# Altium schematic sheet AV Channel.SchDoc
size A4
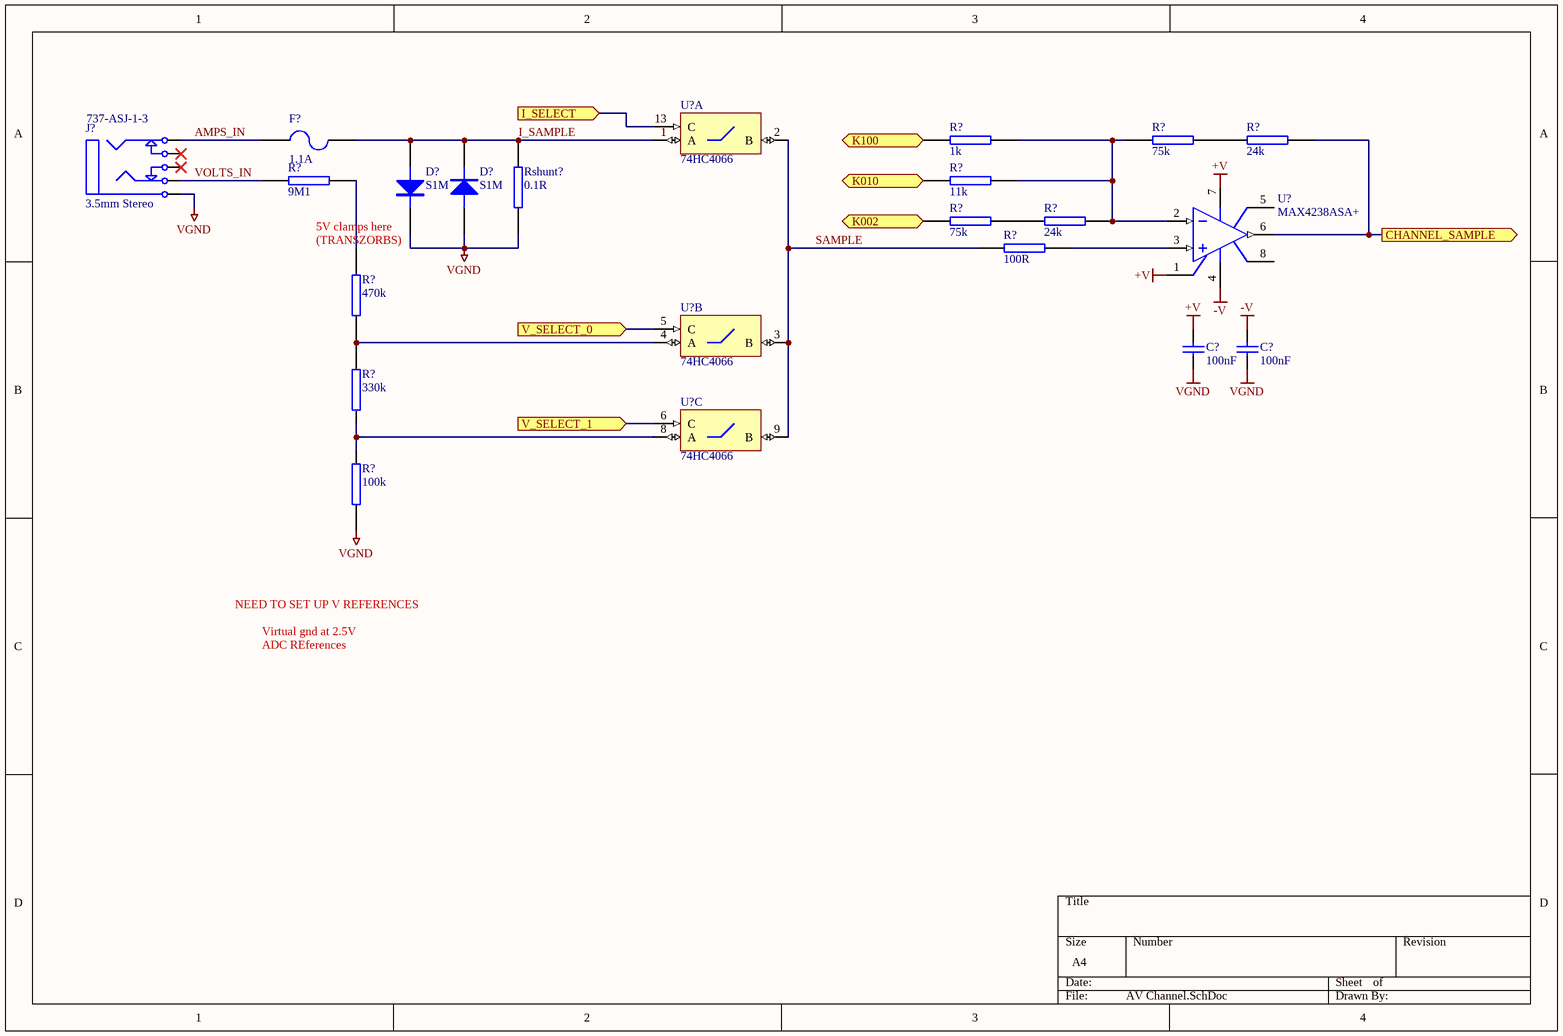
[diagram p0: AV Channel.SchDoc]

## Parts
(Parts that share a designator on the sheet are numbered #1, #2 ... from top to bottom, then left to right.)
C?#1  100nF  [CAP (3D) - 0603]
C?#2  100nF  [CAP (3D) - 0603]
D?#1  S1M  [DO-214AC]
D?#2  S1M  [DO-214AC]
F?  1.1A  [LITTELFUSE 1210]
J?  3.5mm Stereo  Supplier Part Number 1: 737-ASJ-1-3  [3.5MM pcb mouNt]
R?#1  1k  [RES (3D) - 0603]
R?#2  75k  [RES (3D) - 0603]
R?#3  24k  [RES (3D) - 0603]
R?#4  9M1  [RES (3D) - 0603]
R?#5  11k  [RES (3D) - 0603]
R?#6  75k  [RES (3D) - 0603]
R?#7  24k  [RES (3D) - 0603]
R?#8  100R  [RES (3D) - 0603]
R?#9  470k  [RES (3D) - 0603]
R?#10  330k  [RES (3D) - 0603]
R?#11  100k  [RES (3D) - 0603]
Rshunt?  0.1R  [1T-2512]
U?#1  74HC4066  [D014_N]  (part A of 5)
U?#2  MAX4238ASA+  [NSO8_N]
U?#3  74HC4066  [D014_N]  (part B of 5)
U?#4  74HC4066  [D014_N]  (part C of 5)

## Ports
CHANNEL_SAMPLE (out), I_SELECT (in), K002 (in), K010 (in), K100 (in), V_SELECT_0 (in), V_SELECT_1 (in)

## Nets
+V: C?#1.2 U?#2.1(NULL)
-V: C?#2.2 U?#2.4(VEE)
VGND: C?#1.1 C?#2.1 D?#1.2(K) D?#2.1(A) J?.1 R?#11.2 Rshunt?.1
AMPS_IN: F?.1 J?.5
CHANNEL_SAMPLE: R?#3.2 U?#2.6(OUT) ; port CHANNEL_SAMPLE
I_SAMPLE: D?#1.1(A) D?#2.2(K) F?.2 Rshunt?.2 U?#1.1(A)
I_SELECT: U?#1.13(C) ; port I_SELECT
K002: R?#6.1 ; port K002
K010: R?#5.1 ; port K010
K100: R?#1.1 ; port K100
SAMPLE: R?#8.1 U?#1.2(B) U?#3.3(B) U?#4.9(B)
V_SELECT_0: U?#3.5(C) ; port V_SELECT_0
V_SELECT_1: U?#4.6(C) ; port V_SELECT_1
VOLTS_IN: J?.2 R?#4.1
NetR?#1_2: R?#1.2 R?#2.1 R?#5.2 R?#7.2 U?#2.2(IN-)
NetR?#2_2: R?#2.2 R?#3.1
NetR?#4_2: R?#4.2 R?#9.1
NetR?#6_2: R?#6.2 R?#7.1
NetR?#8_2: R?#8.2 U?#2.3(IN+)
NetR?#9_2: R?#9.2 R?#10.1 U?#3.4(A)
NetR?#10_2: R?#10.2 R?#11.1 U?#4.8(A)

Not connected (* = marked no-connect by the designer): J? 3* 4*; U?#2 5(NULL) 7(VCC) 8(NC)

## Notes on the sheet
- (near D?#1) 5V clamps here
- (TRANSZORBS)
- NEED TO SET UP V REFERENCES
- Virtual gnd at 2.5V
- ADC REferences
- Labels drawn without touching a wire or pin: +V

## Library data of the parts
C?#1 C?#2 = Cap: Capacitor; Value: 100nF; Supplier 1: Mouser; Supplier 2: Digi-Key; Supplier Part Number 1: 603-C0603ZRY5V9BB104; Supplier Part Number 2: 311-1343-2-ND
D?#1 D?#2 = DIODE: DIODE, POWER; Manufacturer: TAIWAN SEMI; Mouser Part no.: 821-S1M; Manufacturer Part No.: S1M; value: S1M; Web link: http://au.mouser.com/ProductDetail/Taiwan-Semiconductor/S1M/?qs=sGAEpiMZZMtEwUVCuofpuOlSmRjzJonf%252bmrIm0%252bGbjE%3d
F? = Fuse 2: Fuse; Manufacturer: Littlefuse; Manufacturer Part No.: 1206L110THYR; Revision: July-2002: Re-released for DXP Platform.; Mouser Part No.: 576-1206L110THYR; Value: 1.1A; Web link: http://au.mouser.com/ProductDetail/Littelfuse/1206L110THYR/?qs=sGAEpiMZZMu7EFbsM1w0ne5Dyqsx7igC3NaPmo8Qtk8%3d
J? = Phonejack Stereo SW: 3-Conductor Jack with 2 break contacts (normals) and 2 auxiliary make contacts; Altronics Part no.: P0073; Manufacturer: Neutrik; Manufacturer Part No.: NMJ6HFD2; Mouser Part no.: 550-20301; Web link: http://au.mouser.com/ProductDetail/Neutrik/NMJ6HFD2/?qs=y5MlCMoPWsng3r9W7xlRqw%3d%3d; Supplier 1: Mouser
R?#1-R?#3 R?#5-R?#8 = RES SMD 0603: RESISTOR SMD 0603
  R?#1: value: 1k
  R?#2 R?#6: value: 75k
  R?#3 R?#7: value: 24k
  R?#5: value: 11k
  R?#8: value: 100R
R?#4 = RES SMD 0603 10k: RESISTOR SMD 0603 10k; Manufacturer: Vishay/Dale; Manufacturer Part No.: CRCW06038M06FKEA; Mouser Part no.: 71-CRCW0603-8.06M-E3; Web link: http://au.mouser.com/ProductDetail/Vishay/CRCW06038M06FKEA/?qs=y%252bMD5VLd6nuCUjzPeM%2fNuA%3d%3d; value: 9M1
R?#9-R?#11 = RES SMD 0603 10k: RESISTOR SMD 0603 10k; Manufacturer: 71-CRCW0603-1.62M-E3; Manufacturer Part No.: CRCW06031M62FKEA; Mouser Part no.: Vishay/Dale; Web link: http://au.mouser.com/ProductDetail/Vishay-Dale/CRCW06031M62FKEA/?qs=T8SocJY5PJGlLyODpclhGBx5u7VrWxQmuiInBv9Pchc%3d
  R?#9: value: 470k
  R?#10: value: 330k
  R?#11: value: 100k
Rshunt? = RES SMD 0603 10k: RESISTOR SMD 0603; Manufacturer: Bourns; Manufacturer Part No.: CRM2512-FX-R100ELF; Mouser Part no.: 652-CRM2512FXR100ELF; Web link: http://au.mouser.com/ProductDetail/Bourns/CRM2512-FX-R100ELF/?qs=sGAEpiMZZMtlubZbdhIBIArpNfnoOiiHuLMy8C%2fxrAQ%3d; value: 0.1R
U?#1 U?#3 U?#4 = 74HC4066: Quadruple Bilateral Analog Switch
U?#2 = MAX495CSA: Single Voltage-Feedback Operational Amplifier; Published: 23-Sep-2002; LatestRevisionDate: 13-Apr-2006; LatestRevisionNote: IPC-7351 Footprint Added.; DatasheetVersion: Rev 2; 9/96; PackageReference: NSO8; Publisher: Altium Limited; PackageDescription: 8-Pin Small Outline Integrated Circuit 1.27 mm Pitch; Code_JEDEC: MS-012-AA; Code_IPC: SOIC127P600-8; ComponentLink1Description: Manufacturer Link; ComponentLink1URL: http://www.maxim-ic.com/; ComponentLink2Description: Datasheet; ComponentLink2URL: http://pdfserv.maxim-ic.com/en/ds/MAX492-MAX495.pdf